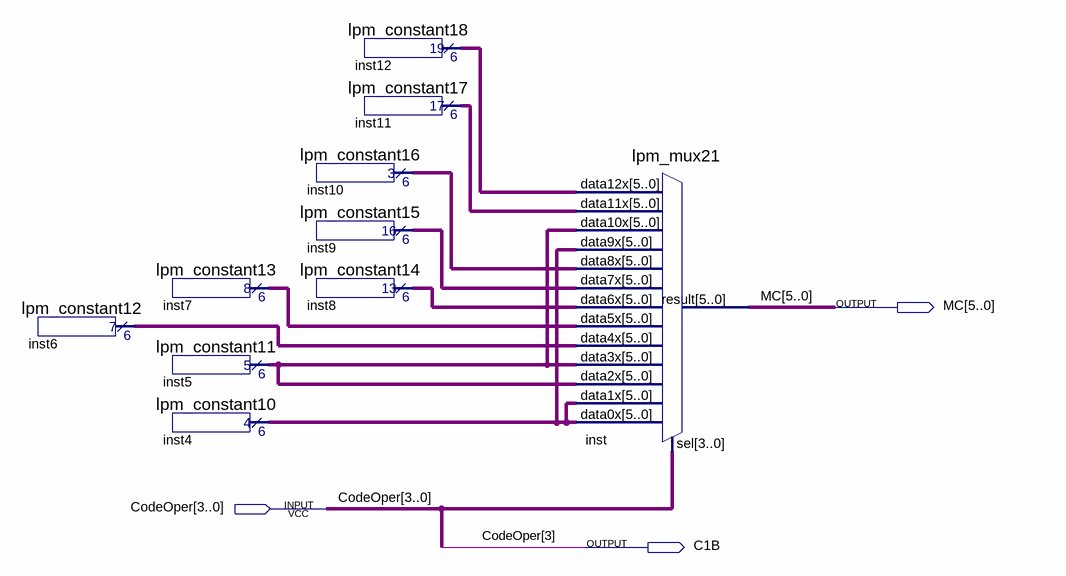
[diagram p0: schematic sheet]
// Quartus schematic Decode.bdf as structural Verilog: 10 symbols, 3 pins
module Decode (
  input  [3:0] CodeOper,
  output [5:0] MC,
  output C1B
);

  wire [5:0] inst4_result, inst5_result, inst6_result, inst7_result, inst8_result, inst9_result,
       inst10_result, inst11_result, inst12_result;

  lpm_constant12 inst6 (.result(inst6_result));
  lpm_constant13 inst7 (.result(inst7_result));
  lpm_constant11 inst5 (.result(inst5_result));
  lpm_constant10 inst4 (.result(inst4_result));
  lpm_constant16 inst10 (.result(inst10_result));
  lpm_constant15 inst9 (.result(inst9_result));
  lpm_constant14 inst8 (.result(inst8_result));
  lpm_constant18 inst12 (.result(inst12_result));
  lpm_constant17 inst11 (.result(inst11_result));
  lpm_mux21 inst (
    .data12x(inst12_result), .data11x(inst11_result), .data10x(inst5_result), .data9x(inst4_result),
    .data8x(inst10_result), .data7x(inst9_result), .data6x(inst8_result), .data5x(inst7_result),
    .data4x(inst6_result), .data3x(inst5_result), .data2x(inst5_result), .data1x(inst4_result),
    .data0x(inst4_result), .sel(CodeOper), .result(MC));

  assign C1B = CodeOper[3];
endmodule
